# Altium schematic sheet PekeeCarte1.SchDoc
size A4
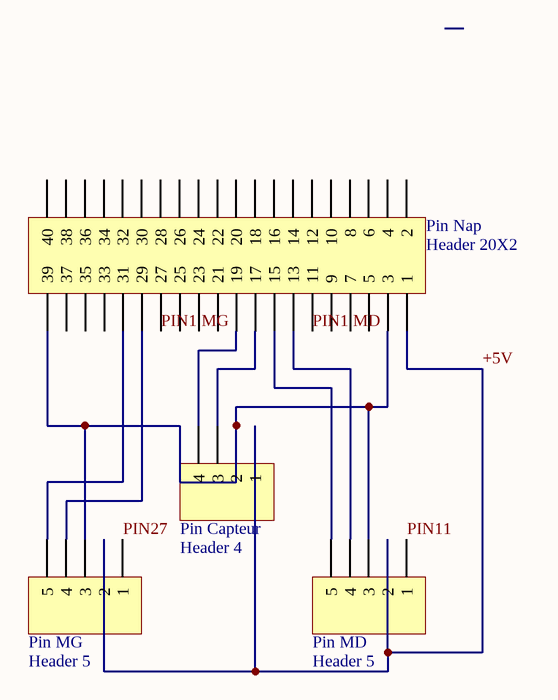
[diagram p0: PekeeCarte1.SchDoc]

## Parts
Pin_Capteur  Header 4  [HDR1X4]
Pin_MD  Header 5  [HDR1X5]
Pin_MG  Header 5  [HDR1X5]
Pin_Nap  Header 20X2  [HDR2X20]

## Nets
+5V: Pin_Capteur.1 Pin_MD.2 Pin_MG.2 Pin_Nap.1
PIN1 MD: Pin_Nap.11
PIN1 MG: Pin_Nap.27
PIN11: Pin_MD.1
PIN27: Pin_MG.1
NetPin_Capteur_2: Pin_Capteur.2 Pin_MD.3 Pin_MG.3 Pin_Nap.3 Pin_Nap.39
NetPin_Capteur_3: Pin_Capteur.3 Pin_Nap.17
NetPin_Capteur_4: Pin_Capteur.4 Pin_Nap.19
NetPin_MD_4: Pin_MD.4 Pin_Nap.13
NetPin_MD_5: Pin_MD.5 Pin_Nap.15
NetPin_MG_4: Pin_MG.4 Pin_Nap.29
NetPin_MG_5: Pin_MG.5 Pin_Nap.31

Not connected (* = marked no-connect by the designer): Pin_Nap 2 4 5 6 7 8 9 10 12 14 16 18 20 21 22 23 24 25 26 28 30 32 33 34 35 36 37 38 40

## Library data of the parts
Pin_Capteur = Header 4: Header, 4-Pin; LatestRevisionDate: 17-Jul-2002; LatestRevisionNote: Re-released for DXP Platform.; Publisher: Altium Limited
Pin_MD Pin_MG = Header 5: Header, 5-Pin; LatestRevisionDate: 17-Jul-2002; LatestRevisionNote: Re-released for DXP Platform.; Publisher: Altium Limited
Pin_Nap = Header 20X2: Header, 20-Pin, Dual row; LatestRevisionDate: 17-Jul-2002; LatestRevisionNote: Re-released for DXP Platform.; Publisher: Altium Limited